# Altium schematic sheet 01_MAIN.SchDoc: =GlobalProjectName
size 594 x 420 mm; CheckedBy: A_D; Author: A_D; SheetNumber: 1; SheetTotal: 2; PageSetup: Record=PageOptions|CenterHorizontal=True|CenterVertical=True|PrintScale=0.70|XCorrection=1.00|YCorrection=1.00|PrintKind=2|BorderSize=5000000|LeftOffset=9000|BottomOffset=10100|Orientation=2|PaperLength=11176|PaperWidth=8636|Scale=100|PaperSource=259|PrintQuality=-3|MediaType=1|DitherType=10|PrintScaleMode=1|PaperKind=A3|PaperIndex=8
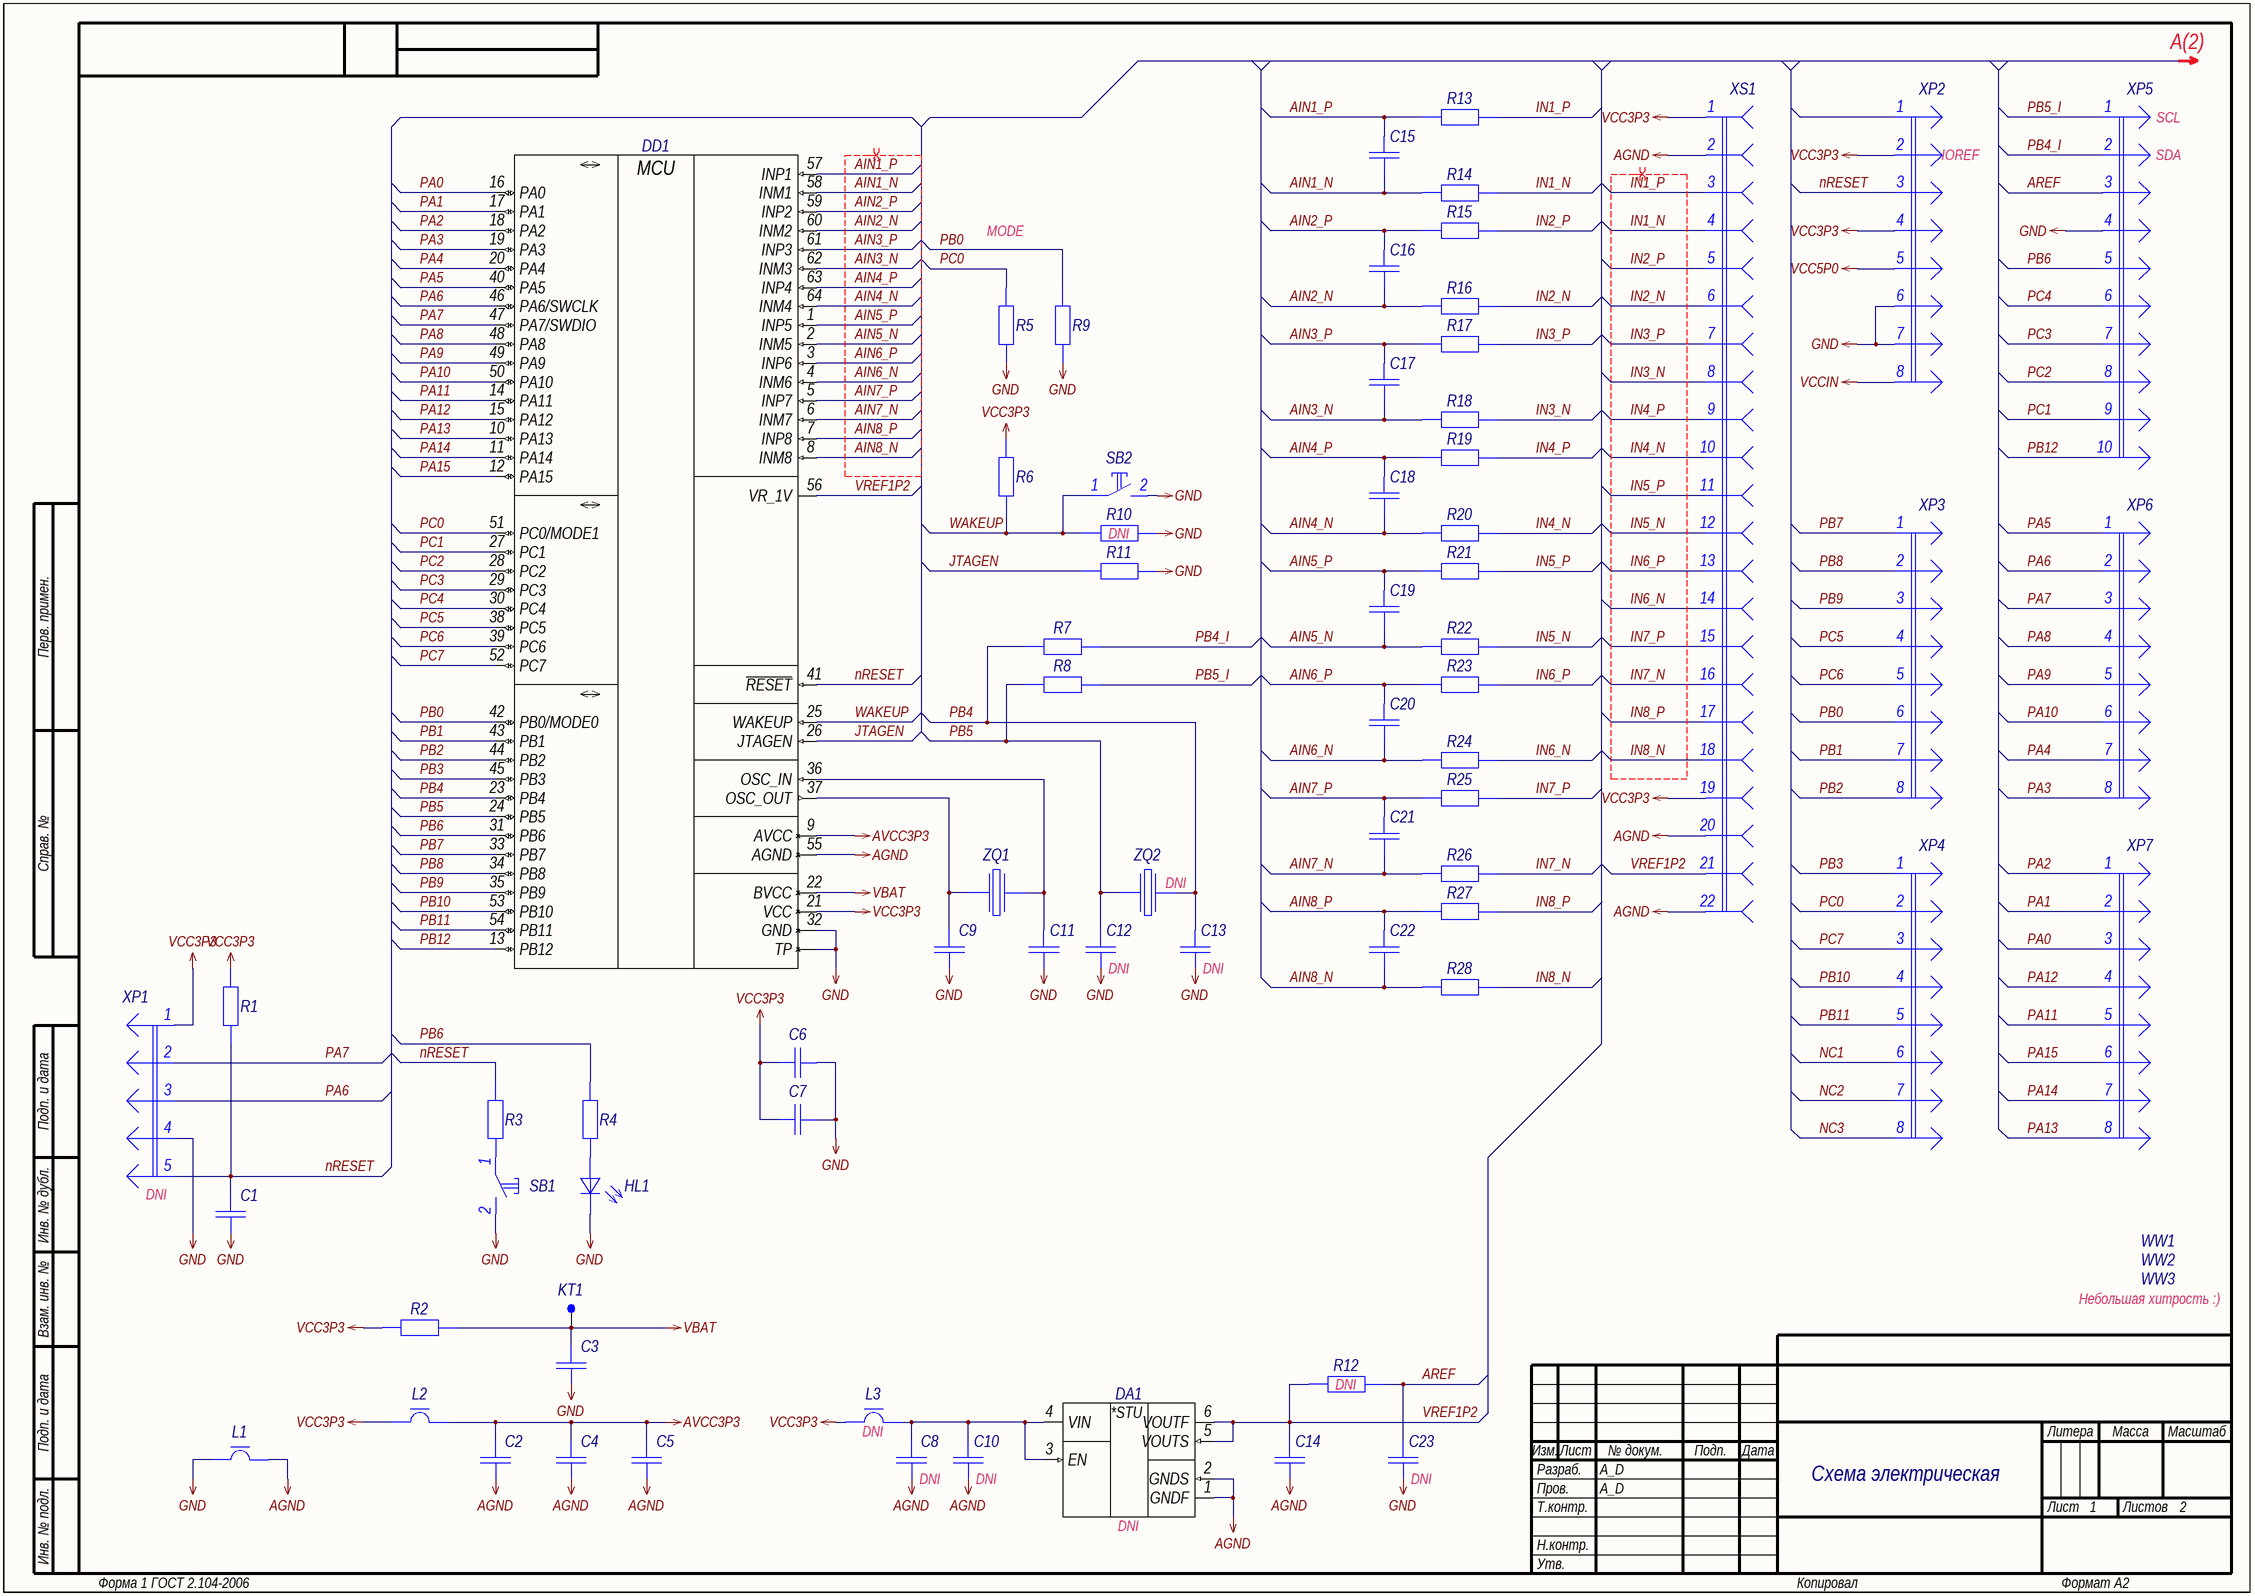
[diagram p0: 01_MAIN.SchDoc]

## Parts
C1  Capacitor  [C0603_L]  (value not drawn)
C2  Capacitor  [C0603_L]  (value not drawn)
C3  Capacitor  [C0603_L]  (value not drawn)
C4  Capacitor  [C0603_L]  (value not drawn)
C5  Capacitor  [C0603_L]  (value not drawn)
C6  Capacitor  [C0603_L]  (value not drawn)
C7  Capacitor  [C0603_L]  (value not drawn)
C8  Capacitor  [C0603_L]  (value not drawn)  (no BOM)
C9  Capacitor  [C0603_L]  (value not drawn)
C10  Capacitor  [C0603_L]  (value not drawn)  (no BOM)
C11  Capacitor  [C0603_L]  (value not drawn)
C12  Capacitor  [C0603_L]  (value not drawn)  (no BOM)
C13  Capacitor  [C0603_L]  (value not drawn)  (no BOM)
C14  Capacitor  [C0603_L]  (value not drawn)
C15  Capacitor  [C0603_L]  (value not drawn)
C16  Capacitor  [C0603_L]  (value not drawn)
C17  Capacitor  [C0603_L]  (value not drawn)
C18  Capacitor  [C0603_L]  (value not drawn)
C19  Capacitor  [C0603_L]  (value not drawn)
C20  Capacitor  [C0603_L]  (value not drawn)
C21  Capacitor  [C0603_L]  (value not drawn)
C22  Capacitor  [C0603_L]  (value not drawn)
C23  Capacitor  [C0603_L]  (value not drawn)  (no BOM)
DA1  ADR34xx-Series  [TSOT-23-6_095P290X160X100_N]  (value not drawn)  (no BOM)
DD1  1986ВЕ4У1-Series  [5153.64-1]  (value not drawn)
HL1  TEST  [LD0603_L]  (value not drawn)
KT1  VBAT  [TP-SMT-C-0.8mm]  (value not drawn)  (no BOM)
L1  FerriteBead  [L0805_L]  (value not drawn)
L2  FerriteBead  [L0603_L]  (value not drawn)
L3  FerriteBead  [L0603_L]  (value not drawn)  (no BOM)
R1  Resistor  [R0603_L]  (value not drawn)
R2  Resistor  [R0603_L]  (value not drawn)
R3  Resistor  [R0603_L]  (value not drawn)
R4  Resistor  [R0603_L]  (value not drawn)
R5  Resistor  [R0603_L]  (value not drawn)
R6  Resistor  [R0603_L]  (value not drawn)
R7  Resistor  [R0603_L]  (value not drawn)
R8  Resistor  [R0603_L]  (value not drawn)
R9  Resistor  [R0603_L]  (value not drawn)
R10  Resistor  [R0603_L]  (value not drawn)  (no BOM)
R11  Resistor  [R0603_L]  (value not drawn)
R12  Resistor  [R0603_L]  (value not drawn)  (no BOM)
R13  Resistor  [R0603_L]  (value not drawn)
R14  Resistor  [R0603_L]  (value not drawn)
R15  Resistor  [R0603_L]  (value not drawn)
R16  Resistor  [R0603_L]  (value not drawn)
R17  Resistor  [R0603_L]  (value not drawn)
R18  Resistor  [R0603_L]  (value not drawn)
R19  Resistor  [R0603_L]  (value not drawn)
R20  Resistor  [R0603_L]  (value not drawn)
R21  Resistor  [R0603_L]  (value not drawn)
R22  Resistor  [R0603_L]  (value not drawn)
R23  Resistor  [R0603_L]  (value not drawn)
R24  Resistor  [R0603_L]  (value not drawn)
R25  Resistor  [R0603_L]  (value not drawn)
R26  Resistor  [R0603_L]  (value not drawn)
R27  Resistor  [R0603_L]  (value not drawn)
R28  Resistor  [R0603_L]  (value not drawn)
SB1  СБРОС  [IT-1185AP]  (value not drawn)
SB2  WAKEUP  [IT-1185AP]  (value not drawn)
WW1  NoBody  [Mark-Fiducial_2.00mm]  (value not drawn)  (no BOM)
WW2  NoBody  [Mark-Fiducial_2.00mm]  (value not drawn)  (no BOM)
WW3  NoBody  [Mark-Fiducial_2.00mm]  (value not drawn)  (no BOM)
XP1  Prog  [PLS-5]  (value not drawn)  (no BOM)
XP2  Text  [PLS-8]  (value not drawn)
XP3  Text  [PLS-8]  (value not drawn)
XP4  Text  [PLS-8]  (value not drawn)
XP5  Text  [PLS-10]  (value not drawn)
XP6  Text  [PLS-8]  (value not drawn)
XP7  Text  [PLS-8]  (value not drawn)
XS1  ADC  [PBD-22]  (value not drawn)
ZQ1  Crystal  [SMD 5x3.2mm]  (value not drawn)
ZQ2  Crystal-1_4p  [DSO-N4]  (value not drawn)  (no BOM)

## Nets
AGND: C2.1 C4.1 C5.1 C8.1 C10.1 C14.1 DA1.1(GNDF) DA1.2(GNDS) DD1.55(AGND) L1.2 XS1.2 XS1.20 XS1.22
AVCC3P3: C2.2 C4.2 C5.2 DD1.9(AVCC) L2.2
GND: C1.1 C3.1 C6.1 C7.1 C9.1 C11.1 C12.1 C13.1 C23.1 DD1.32(GND) DD1.TP HL1.2(К) L1.1 R5.1 R9.1 R10.2 R11.2 SB1.2 SB2.2 XP1.4 XP2.6 XP2.7 XP5.4
VBAT: C3.2 DD1.22(BVCC) KT1.1 R2.2
VCC3P3: C6.2 C7.2 DD1.21(VCC) L2.1 L3.1 R1.2 R2.1 R6.2 XP1.1 XP2.2 XP2.4 XS1.1 XS1.19
VCC5P0: XP2.5
VCCIN: XP2.8
AIN1_N: C15.1 DD1.58(INM1) R14.1
AIN1_P: C15.2 DD1.57(INP1) R13.1
AIN2_N: C16.1 DD1.60(INM2) R16.1
AIN2_P: C16.2 DD1.59(INP2) R15.1
AIN3_N: C17.1 DD1.62(INM3) R18.1
AIN3_P: C17.2 DD1.61(INP3) R17.1
AIN4_N: C18.1 DD1.64(INM4) R20.1
AIN4_P: C18.2 DD1.63(INP4) R19.1
AIN5_N: C19.1 DD1.2(INM5) R22.1
AIN5_P: C19.2 DD1.1(INP5) R21.1
AIN6_N: C20.1 DD1.4(INM6) R24.1
AIN6_P: C20.2 DD1.3(INP6) R23.1
AIN7_N: C21.1 DD1.6(INM7) R26.1
AIN7_P: C21.2 DD1.5(INP7) R25.1
AIN8_N: C22.1 DD1.8(INM8) R28.1
AIN8_P: C22.2 DD1.7(INP8) R27.1
AREF: C23.2 R12.2 XP5.3
IN1_N: R14.2 XS1.4
IN1_P: R13.2 XS1.3
IN2_N: R16.2 XS1.6
IN2_P: R15.2 XS1.5
IN3_N: R18.2 XS1.8
IN3_P: R17.2 XS1.7
IN4_N: R20.2 XS1.10
IN4_P: R19.2 XS1.9
IN5_N: R22.2 XS1.12
IN5_P: R21.2 XS1.11
IN6_N: R24.2 XS1.14
IN6_P: R23.2 XS1.13
IN7_N: R26.2 XS1.16
IN7_P: R25.2 XS1.15
IN8_N: R28.2 XS1.18
IN8_P: R27.2 XS1.17
JTAGEN: DD1.26(JTAGEN) R11.1
NC1: XP4.6
NC2: XP4.7
NC3: XP4.8
nRESET: C1.2 DD1.41(~{RESET}) R1.1 R3.2 XP1.5 XP2.3
PA0: DD1.16(PA0) XP7.3
PA1: DD1.17(PA1) XP7.2
PA2: DD1.18(PA2) XP7.1
PA3: DD1.19(PA3) XP6.8
PA4: DD1.20(PA4) XP6.7
PA5: DD1.40(PA5) XP6.1
PA6: DD1.46(PA6/SWCLK) XP1.3 XP6.2
PA7: DD1.47(PA7/SWDIO) XP1.2 XP6.3
PA8: DD1.48(PA8) XP6.4
PA9: DD1.49(PA9) XP6.5
PA10: DD1.50(PA10) XP6.6
PA11: DD1.14(PA11) XP7.5
PA12: DD1.15(PA12) XP7.4
PA13: DD1.10(PA13) XP7.8
PA14: DD1.11(PA14) XP7.7
PA15: DD1.12(PA15) XP7.6
PB0: DD1.42(PB0/MODE0) R9.2 XP3.6
PB1: DD1.43(PB1) XP3.7
PB2: DD1.44(PB2) XP3.8
PB3: DD1.45(PB3) XP4.1
PB4: C13.2 DD1.23(PB4) R7.1 ZQ2.1
PB4_I: R7.2 XP5.2
PB5: C12.2 DD1.24(PB5) R8.1 ZQ2.4
PB5_I: R8.2 XP5.1
PB6: DD1.31(PB6) R4.2 XP5.5
PB7: DD1.33(PB7) XP3.1
PB8: DD1.34(PB8) XP3.2
PB9: DD1.35(PB9) XP3.3
PB10: DD1.53(PB10) XP4.4
PB11: DD1.54(PB11) XP4.5
PB12: DD1.13(PB12) XP5.10
PC0: DD1.51(PC0/MODE1) R5.2 XP4.2
PC1: DD1.27(PC1) XP5.9
PC2: DD1.28(PC2) XP5.8
PC3: DD1.29(PC3) XP5.7
PC4: DD1.30(PC4) XP5.6
PC5: DD1.38(PC5) XP3.4
PC6: DD1.39(PC6) XP3.5
PC7: DD1.52(PC7) XP4.3
VREF1P2: C14.2 DA1.5(VOUTS) DA1.6(VOUTF) DD1.56(VR_1V) R12.1 XS1.21
WAKEUP: DD1.25(WAKEUP) R6.1 R10.1 SB2.1
NetC8_2: C8.2 C10.2 DA1.3(EN) DA1.4(VIN) L3.2
NetC9_2: C9.2 DD1.37(OSC_OUT) ZQ1.1
NetC11_2: C11.2 DD1.36(OSC_IN) ZQ1.3
NetHL1_1: HL1.1(А) R4.1
NetR3_1: R3.1 SB1.1

Not connected (* = marked no-connect by the designer): XP2 1

## Layout directives
differential pair: AIN1_N, AIN1_P, AIN2_N, AIN2_P, AIN3_N, AIN3_P, AIN4_N, AIN4_P, AIN5_N, AIN5_P, AIN6_N, AIN6_P, AIN7_N, AIN7_P, AIN8_N, AIN8_P, IN1_N, IN1_P, IN2_N, IN2_P, IN3_N, IN3_P, IN4_N, IN4_P, IN5_N, IN5_P, IN6_N, IN6_P, IN7_N, IN7_P, IN8_N, IN8_P

## Notes on the sheet
- А(2)
- (near XP5) SCL
- (near XP2) IOREF
- (near XP5) SDA
- MODE
- (near R10) DNI
- (near ZQ2) DNI
- (near C12) DNI
- (near C13) DNI
- (near XP1) DNI
- (near WW3) Небольшая хитрость :)
- (near R12) DNI
- (near L3) DNI
- (near C8) DNI
- (near C10) DNI
- (near C23) DNI
- Схема электрическая
  принципиальная
- (near DA1) DNI
- Перв. примен.
- Справ. №
- Подп. и дата
- Инв. № дубл.
- Взам. инв. №
- Разраб.
- Изм.
- Лист
- № докум.
- Подп.
- Дата
- Литера
- Масса
- Масштаб
- Пров.
- Т.контр.
- Листов
- Инв. № подл.
- Н.контр.
- Утв.
- Форма 1 ГОСТ 2.104-2006
- Копировал
- Формат А2
- (in symbol ADR3412ARJZ-R7) *STU
- (in symbol К1986ВЕ4У1К) MCU

## Library data of the parts
C1 C3 C4 C6 C10 C14 C23 = GRM188R72A104KA35D: Manufacturer: Murata; Type: Конденсатор; ID: 232; Value: 0.1uF; Voltage: 100V; Tolerance: ±10%; Dielectric Type: X7R; Application Category: 1; Working Temperature Min: -55°С; Working Temperature Max: +125°С; Published: 18.05.2010; Publisher: Andrew Danich; Part Number: GRM188R72A104KA35D; Footprint: 0603
C2 = GRM188R60J106ME47D: Manufacturer: Murata; Type: Конденсатор; ID: 136; Value: 10uF; Voltage: 6.3V; Tolerance: ±20%; Dielectric Type: X5R; Application Category: 1; Working Temperature Min: -55°С; Working Temperature Max: +85°С; Published: 18.05.2010; Publisher: Andrew Danich; Part Number: GRM188R60J106ME47D; Footprint: 0603
C5 = GCJ188R72A103KA01D: Manufacturer: Murata; Type: Конденсатор; ID: 130; Value: 0.01uF; Voltage: 100V; Tolerance: ±10%; Dielectric Type: X7R; Application Category: 1; Working Temperature Min: -55°С; Working Temperature Max: +125°С; Published: 18.05.2010; Publisher: Andrew Danich; Part Number: GCJ188R72A103KA01D; Footprint: 0603
C7 C8 = GCM188R71E105KA64D: Manufacturer: Murata; Type: Конденсатор; ID: 134; Value: 1uF; Voltage: 25V; Tolerance: ±10%; Dielectric Type: X7R; Application Category: 1; Working Temperature Min: -55°С; Working Temperature Max: +85°С; Published: 18.05.2010; Publisher: Andrew Danich; Part Number: GCM188R71E105KA64D; Footprint: 0603
C9 C11 = GCM1885C1H150JA16D: Manufacturer: Murata; Type: Конденсатор; ID: 214; Value: 15pF; Voltage: 50V; Tolerance: ±5%; Dielectric Type: NP0; Application Category: 1; Working Temperature Min: -55°С; Working Temperature Max: +125°С; Published: 18.05.2010; Publisher: Andrew Danich; Part Number: GCM1885C1H150JA16D; Footprint: 0603
C12 C13 = GCM1885C2A120JA16D: Manufacturer: Murata; Type: Конденсатор; ID: 121; Value: 12pF; Voltage: 100V; Tolerance: ±5%; Dielectric Type: NP0; Application Category: 1; Working Temperature Min: -55°С; Working Temperature Max: +125°С; Published: 18.05.2010; Publisher: Andrew Danich; Part Number: GCM1885C2A120JA16D; Footprint: 0603
C15-C22 = GCM1885C2A101JA16D: Manufacturer: Murata; Type: Конденсатор; ID: 155; Value: 100pF; Voltage: 100V; Tolerance: ±5%; Dielectric Type: NP0; Application Category: 1; Working Temperature Min: -55°С; Working Temperature Max: +125°С; Published: 18.05.2010; Publisher: Andrew Danich; Part Number: GCM1885C2A101JA16D; Footprint: 0603
DA1 = ADR3412ARJZ-R7: Manufacturer: Analog Devices; ID: 18; Input Voltage: +2.3…5.5V; Output Current: 10mA; Output Voltage: +1.2V; Temperature Coefficient: 8ppm; Supply Current: 85uA; Application Category: 1; Working Temperature Min: -40°С; Working Temperature Max: +125°С; Functional Analog: ADR3412ARJZ-R2; Published: 01.10.2018; Publisher: Andrew Danich; Type: Микросхема; Part Number: ADR3412ARJZ-R7; Value: ADR3412ARJZ-R7
DD1 = К1986ВЕ4У1К: Manufacturer: Миландр; ID: 1; Supply Operation: +2.2…3.6V; Flash: 128Kb; SRAM: 16Kb; Prog Interface: SWD, JTAG; I/O Lines: 36; Operation Frequency: 36MHz; Specification: АЕЯР.431280.912 ТУ; Working Temperature Min: 0°С; Working Temperature Max: +70°С; Functional Analog: К1986ВЕ4У1, 1986ВЕ4У1; Published: 24.08.2018; Publisher: Andrew Danich; Type: Микросхема; Part Number: К1986ВЕ4У1К; Value: К1986ВЕ4У1К; EEPROM: -; Application Category: 1
HL1 = BL-LS0603DNB: Type: Индикатор единичный; ID: 12; Forward Voltage: 3.5V; Forward Current: 30mA; Power Dissipation: 78mW; Color: Blue; Leds: 1; Published: 03.12.2013; Publisher: Andrew Danich; Part Number: BL-LS0603DNB; Value: BL-LS0603DNB; Footprint: 0603; Application Category: 1
KT1 = TestPoint-SMT: ID: 6; Application Type: On PCB Test Point; Application Category: 1; Published: 03.03.2015; Publisher: Andrew Danich; Part Number: TestPoint-SMT; Value: TestPoint-SMT; Manufacturer: -; Functional Analog: -
L1 = BLM21PG331SN1: Manufacturer: Murata; Type: Дроссель; ID: 2; Rated Current: 1.5A; Impedance at 100Mhz: 330ohm; Tolerance: ±25%; DC Resistance: 0.07ohm; Inductor Type: EMIFIL; Application Category: 1; Working Temperature Min: -55°С; Working Temperature Max: +125°С; Published: 14.11.2014; Publisher: Andrew Danich; Part Number: BLM21PG331SN1; Value: BLM21PG331SN1; Footprint: 0805; ClassName: PolyDirectConnect
L2 L3 = BLM18PG331SN1: Manufacturer: Murata; Type: Дроссель; ID: 1; Rated Current: 1.2A; Impedance at 100Mhz: 330ohm; Tolerance: ±25%; DC Resistance: 0.15ohm; Inductor Type: EMIFIL; Working Temperature Min: -55°С; Working Temperature Max: +125°С; Published: 14.11.2014; Publisher: Andrew Danich; Part Number: BLM18PG331SN1; Value: BLM18PG331SN1; Footprint: 0603; Application Category: 1
R1 R5 R6 R9 = RC0603JR-0710KL: Manufacturer: Yageo; ID: 12; Value: 10k; Limit Voltage: 50V; Tolerance: ±5%; Temperature Coefficient: 100ppm; Total Power Dissipation: 0.1W; Series Type: Thick-Film; Application Category: 1; Working Temperature Min: -55°С; Working Temperature Max: +155°С; Functional Analog: CR0603-JW-103E; Published: 24.03.2010; Publisher: Andrew Danich; Type: Резистор; Part Number: RC0603JR-0710KL; Footprint: 0603
R2 R7 R8 R10-R12 = RC0603JR-070R: Manufacturer: Yageo; ID: 5; Value: 0; Limit Voltage: 50V; Tolerance: ±5%; Temperature Coefficient: 100ppm; Total Power Dissipation: 0.1W; Series Type: Thick-Film; Application Category: 1; Working Temperature Min: -55°С; Working Temperature Max: +155°С; Functional Analog: RC0603FR-070RL, CR0603-J/-000E; Published: 24.03.2010; Publisher: Andrew Danich; Type: Резистор; Part Number: RC0603JR-070R; Footprint: 0603
R3 = RC0603JR-07100R: Manufacturer: Yageo; ID: 10; Value: 100; Limit Voltage: 50V; Tolerance: ±5%; Temperature Coefficient: 100ppm; Total Power Dissipation: 0.1W; Series Type: Thick-Film; Application Category: 1; Working Temperature Min: -55°С; Working Temperature Max: +155°С; Functional Analog: CR0603-JW-101E; Published: 24.03.2010; Publisher: Andrew Danich; Type: Резистор; Part Number: RC0603JR-07100R; Footprint: 0603
R4 = RC0603JR-07330RL: Manufacturer: Yageo; ID: 313; Value: 330; Limit Voltage: 50V; Tolerance: ±5%; Temperature Coefficient: 100ppm; Total Power Dissipation: 0.1W; Series Type: Thick-Film; Application Category: 1; Working Temperature Min: -55°С; Working Temperature Max: +155°С; Functional Analog: CR0603-JW-331E; Published: 24.03.2010; Publisher: Andrew Danich; Type: Резистор; Part Number: RC0603JR-07330RL; Footprint: 0603
R13-R28 = RC0603FR-0749R9L: Manufacturer: Yageo; ID: 249; Value: 49.9; Limit Voltage: 50V; Tolerance: ±1%; Temperature Coefficient: 100ppm; Total Power Dissipation: 0.1W; Series Type: Thick-Film; Application Category: 1; Working Temperature Min: -55°С; Working Temperature Max: +155°С; Functional Analog: CR0603-FX-49R9E; Published: 24.03.2010; Publisher: Andrew Danich; Type: Резистор; Part Number: RC0603FR-0749R9L; Footprint: 0603
SB1 SB2 = IT-1185AP: ID: 36; Limit Current: 50mA; Resistance: 0.1ohm; Isolator Resistance: 100meg; Backlight: NO; Number of Contacts: 2; Application Category: 1; Published: 17.04.2014; Publisher: Andrew Danich; Type: Переключатель; Part Number: IT-1185AP; Value: IT-1185AP; Height: 5mm
WW1-WW3 = MARK_FIDUCIAL: ID: 3; Published: 24.03.2015; Publisher: Andrew Danich; Type: Лепесток; Part Number: MARK_FIDUCIAL; Value: MARK_FIDUCIAL
XP1 = PLS-5: Value: PLS-5; ID: 4; Limit Voltage: 250V; Limit Current: 3A; Connector Type: Male; Resistance: 15momh; Surface Finish: Gold; Pitch: 2.54mm; Application Category: 1; Published: 07.03.2013; Publisher: Andrew Danich; Type: Вилка; Part Number: PLS-5; Pins: 5
XP2-XP4 XP6 XP7 = PLS-8: Value: PLS-8; ID: 7; Limit Voltage: 250V; Limit Current: 3A; Connector Type: Male; Resistance: 15momh; Surface Finish: Gold; Pitch: 2.54mm; Application Category: 1; Published: 07.03.2013; Publisher: Andrew Danich; Type: Вилка; Part Number: PLS-8; Pins: 8
XP5 = PLS-10: Value: PLS-10; ID: 9; Limit Voltage: 250V; Limit Current: 3A; Connector Type: Male; Resistance: 15momh; Surface Finish: Gold; Pitch: 2.54mm; Application Category: 1; Published: 07.03.2013; Publisher: Andrew Danich; Type: Вилка; Part Number: PLS-10; Pins: 10
XS1 = PBD-22: Value: PBD-22; ID: 83; Limit Voltage: 250V; Limit Current: 3A; Connector Type: Female; Resistance: 15momh; Surface Finish: Gold; Pitch: 2.54mm; Application Category: 1; Published: 01.12.2018; Publisher: Andrew Danich; Type: Розетка; Part Number: PBD-22; Pins: 22
ZQ1 = KX-9A 8.0 MHz 30/50/100 16 pF: Manufacturer: Geyer; ID: 12; Output Frequency: 8MHz; Shunt Capacitance: 5pF; Load Capacitance: 16pF; Temperature Coefficient: ±50ppm; Application Category: 1; Working Temperature Min: -20°С; Working Temperature Max: +70°С; Published: 08.03.2013; Publisher: Andrew Danich; Type: Резонатор; Part Number: KX-9A 8.0 MHz 30/50/100 16 pF; Value: KX-9A 8.0 MHz 30/50/100 16 pF; Functional Analog: -
ZQ2 = MC306-32.768KHz: Manufacturer: Seiko Epson Corporation; ID: 11; Shunt Capacitance: 0.9pF; Load Capacitance: 12.5pF; Application Category: 1; Working Temperature Min: -40°С; Working Temperature Max: +85°С; Published: 12.09.2014; Publisher: Andrew Danich; Type: Резонатор; Part Number: MC306-32.768KHz; Value: MC306-32.768KHz; Output Frequency: 32.768KHz; Functional Analog: -